# Altium schematic sheet Ring Flex Connector.SchDoc
size A2
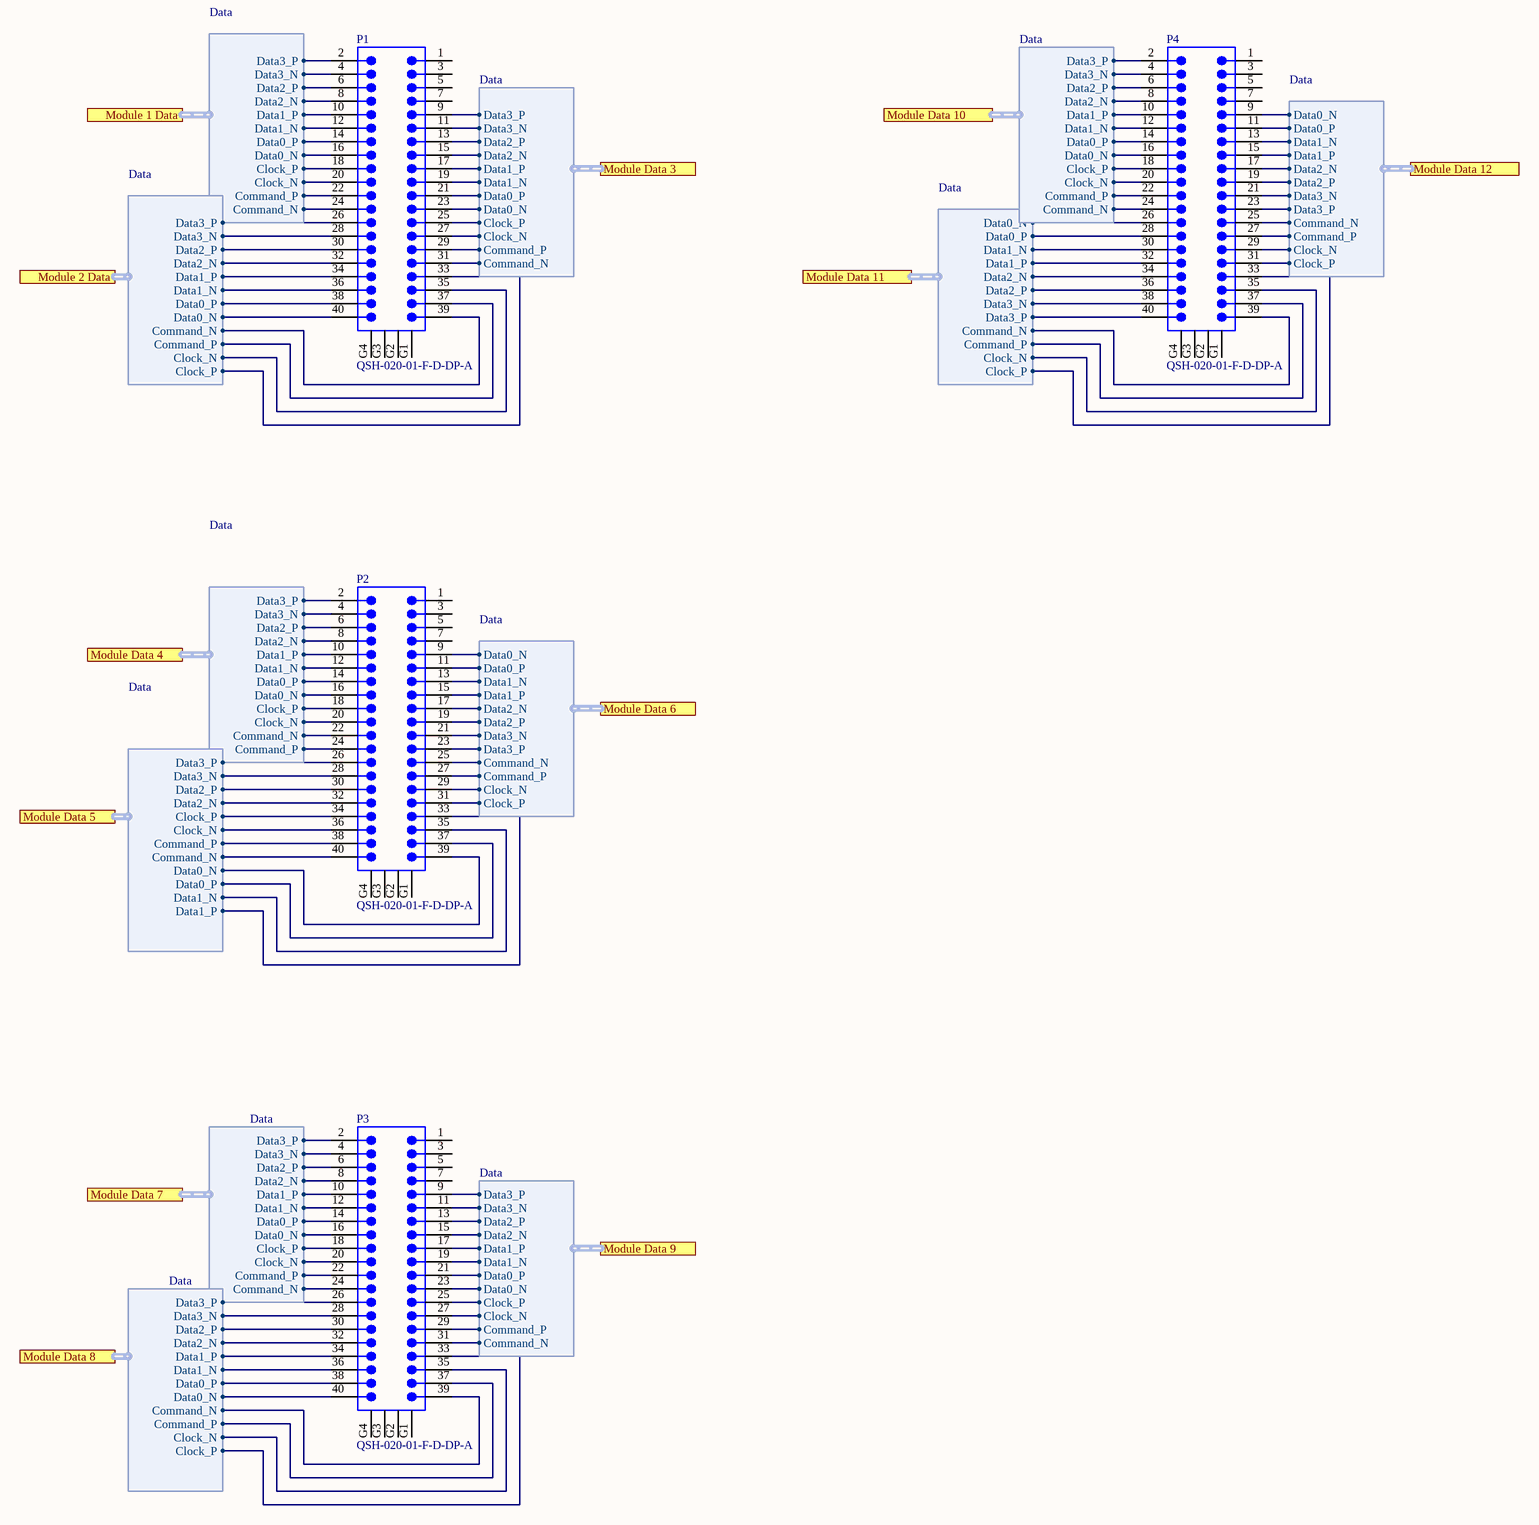
[diagram p0: Ring Flex Connector.SchDoc]

## Parts
P1  QSH-020-01-F-D-DP-A  [QSH-020-01-X-D-DP-A]
P2  QSH-020-01-F-D-DP-A  [QSH-020-01-X-D-DP-A]
P3  QSH-020-01-F-D-DP-A  [QSH-020-01-X-D-DP-A]
P4  QSH-020-01-F-D-DP-A  [QSH-020-01-X-D-DP-A]

## Ports
Module 1 Data (harness Data), Module 2 Data (harness Data), Module Data 3 (harness Data), Module Data 4 (harness Data), Module Data 5 (harness Data), Module Data 6 (harness Data), Module Data 7 (harness Data), Module Data 8 (harness Data), Module Data 9 (harness Data), Module Data 10 (harness Data), Module Data 11 (harness Data), Module Data 12 (harness Data)

## Harnesses
Data: Data0_N, Data0_P, Data1_N, Data1_P, Data2_N, Data2_P, Data3_N, Data3_P, Clock_P, Clock_N, Command_P, Command_N

## Nets
NetP1_2: P1.2 ; port Module 1 Data.Data3_P
NetP1_4: P1.4 ; port Module 1 Data.Data3_N
NetP1_6: P1.6 ; port Module 1 Data.Data2_P
NetP1_8: P1.8 ; port Module 1 Data.Data2_N
NetP1_9: P1.9 ; port Module Data 3.Data3_P
NetP1_10: P1.10 ; port Module 1 Data.Data1_P
NetP1_11: P1.11 ; port Module Data 3.Data3_N
NetP1_12: P1.12 ; port Module 1 Data.Data1_N
NetP1_13: P1.13 ; port Module Data 3.Data2_P
NetP1_14: P1.14 ; port Module 1 Data.Data0_P
NetP1_15: P1.15 ; port Module Data 3.Data2_N
NetP1_16: P1.16 ; port Module 1 Data.Data0_N
NetP1_17: P1.17 ; port Module Data 3.Data1_P
NetP1_18: P1.18 ; port Module 1 Data.Clock_P
NetP1_19: P1.19 ; port Module Data 3.Data1_N
NetP1_20: P1.20 ; port Module 1 Data.Clock_N
NetP1_21: P1.21 ; port Module Data 3.Data0_P
NetP1_22: P1.22 ; port Module 1 Data.Command_P
NetP1_23: P1.23 ; port Module Data 3.Data0_N
NetP1_24: P1.24 ; port Module 1 Data.Command_N
NetP1_25: P1.25 ; port Module Data 3.Clock_P
NetP1_26: P1.26 ; port Module 2 Data.Data3_P
NetP1_27: P1.27 ; port Module Data 3.Clock_N
NetP1_28: P1.28 ; port Module 2 Data.Data3_N
NetP1_29: P1.29 ; port Module Data 3.Command_P
NetP1_30: P1.30 ; port Module 2 Data.Data2_P
NetP1_31: P1.31 ; port Module Data 3.Command_N
NetP1_32: P1.32 ; port Module 2 Data.Data2_N
NetP1_33: P1.33 ; port Module 2 Data.Clock_P
NetP1_34: P1.34 ; port Module 2 Data.Data1_P
NetP1_35: P1.35 ; port Module 2 Data.Clock_N
NetP1_36: P1.36 ; port Module 2 Data.Data1_N
NetP1_37: P1.37 ; port Module 2 Data.Command_P
NetP1_38: P1.38 ; port Module 2 Data.Data0_P
NetP1_39: P1.39 ; port Module 2 Data.Command_N
NetP1_40: P1.40 ; port Module 2 Data.Data0_N
NetP2_2: P2.2 ; port Module Data 4.Data3_P
NetP2_4: P2.4 ; port Module Data 4.Data3_N
NetP2_6: P2.6 ; port Module Data 4.Data2_P
NetP2_8: P2.8 ; port Module Data 4.Data2_N
NetP2_9: P2.9 ; port Module Data 6.Data0_N
NetP2_10: P2.10 ; port Module Data 4.Data1_P
NetP2_11: P2.11 ; port Module Data 6.Data0_P
NetP2_12: P2.12 ; port Module Data 4.Data1_N
NetP2_13: P2.13 ; port Module Data 6.Data1_N
NetP2_14: P2.14 ; port Module Data 4.Data0_P
NetP2_15: P2.15 ; port Module Data 6.Data1_P
NetP2_16: P2.16 ; port Module Data 4.Data0_N
NetP2_17: P2.17 ; port Module Data 6.Data2_N
NetP2_18: P2.18 ; port Module Data 4.Clock_P
NetP2_19: P2.19 ; port Module Data 6.Data2_P
NetP2_20: P2.20 ; port Module Data 4.Clock_N
NetP2_21: P2.21 ; port Module Data 6.Data3_N
NetP2_22: P2.22 ; port Module Data 4.Command_N
NetP2_23: P2.23 ; port Module Data 6.Data3_P
NetP2_24: P2.24 ; port Module Data 4.Command_P
NetP2_25: P2.25 ; port Module Data 6.Command_N
NetP2_26: P2.26 ; port Module Data 5.Data3_P
NetP2_27: P2.27 ; port Module Data 6.Command_P
NetP2_28: P2.28 ; port Module Data 5.Data3_N
NetP2_29: P2.29 ; port Module Data 6.Clock_N
NetP2_30: P2.30 ; port Module Data 5.Data2_P
NetP2_31: P2.31 ; port Module Data 6.Clock_P
NetP2_32: P2.32 ; port Module Data 5.Data2_N
NetP2_33: P2.33 ; port Module Data 5.Data1_P
NetP2_34: P2.34 ; port Module Data 5.Clock_P
NetP2_35: P2.35 ; port Module Data 5.Data1_N
NetP2_36: P2.36 ; port Module Data 5.Clock_N
NetP2_37: P2.37 ; port Module Data 5.Data0_P
NetP2_38: P2.38 ; port Module Data 5.Command_P
NetP2_39: P2.39 ; port Module Data 5.Data0_N
NetP2_40: P2.40 ; port Module Data 5.Command_N
NetP3_2: P3.2 ; port Module Data 7.Data3_P
NetP3_4: P3.4 ; port Module Data 7.Data3_N
NetP3_6: P3.6 ; port Module Data 7.Data2_P
NetP3_8: P3.8 ; port Module Data 7.Data2_N
NetP3_9: P3.9 ; port Module Data 9.Data3_P
NetP3_10: P3.10 ; port Module Data 7.Data1_P
NetP3_11: P3.11 ; port Module Data 9.Data3_N
NetP3_12: P3.12 ; port Module Data 7.Data1_N
NetP3_13: P3.13 ; port Module Data 9.Data2_P
NetP3_14: P3.14 ; port Module Data 7.Data0_P
NetP3_15: P3.15 ; port Module Data 9.Data2_N
NetP3_16: P3.16 ; port Module Data 7.Data0_N
NetP3_17: P3.17 ; port Module Data 9.Data1_P
NetP3_18: P3.18 ; port Module Data 7.Clock_P
NetP3_19: P3.19 ; port Module Data 9.Data1_N
NetP3_20: P3.20 ; port Module Data 7.Clock_N
NetP3_21: P3.21 ; port Module Data 9.Data0_P
NetP3_22: P3.22 ; port Module Data 7.Command_P
NetP3_23: P3.23 ; port Module Data 9.Data0_N
NetP3_24: P3.24 ; port Module Data 7.Command_N
NetP3_25: P3.25 ; port Module Data 9.Clock_P
NetP3_26: P3.26 ; port Module Data 8.Data3_P
NetP3_27: P3.27 ; port Module Data 9.Clock_N
NetP3_28: P3.28 ; port Module Data 8.Data3_N
NetP3_29: P3.29 ; port Module Data 9.Command_P
NetP3_30: P3.30 ; port Module Data 8.Data2_P
NetP3_31: P3.31 ; port Module Data 9.Command_N
NetP3_32: P3.32 ; port Module Data 8.Data2_N
NetP3_33: P3.33 ; port Module Data 8.Clock_P
NetP3_34: P3.34 ; port Module Data 8.Data1_P
NetP3_35: P3.35 ; port Module Data 8.Clock_N
NetP3_36: P3.36 ; port Module Data 8.Data1_N
NetP3_37: P3.37 ; port Module Data 8.Command_P
NetP3_38: P3.38 ; port Module Data 8.Data0_P
NetP3_39: P3.39 ; port Module Data 8.Command_N
NetP3_40: P3.40 ; port Module Data 8.Data0_N
NetP4_2: P4.2 ; port Module Data 10.Data3_P
NetP4_4: P4.4 ; port Module Data 10.Data3_N
NetP4_6: P4.6 ; port Module Data 10.Data2_P
NetP4_8: P4.8 ; port Module Data 10.Data2_N
NetP4_9: P4.9 ; port Module Data 12.Data0_N
NetP4_10: P4.10 ; port Module Data 10.Data1_P
NetP4_11: P4.11 ; port Module Data 12.Data0_P
NetP4_12: P4.12 ; port Module Data 10.Data1_N
NetP4_13: P4.13 ; port Module Data 12.Data1_N
NetP4_14: P4.14 ; port Module Data 10.Data0_P
NetP4_15: P4.15 ; port Module Data 12.Data1_P
NetP4_16: P4.16 ; port Module Data 10.Data0_N
NetP4_17: P4.17 ; port Module Data 12.Data2_N
NetP4_18: P4.18 ; port Module Data 10.Clock_P
NetP4_19: P4.19 ; port Module Data 12.Data2_P
NetP4_20: P4.20 ; port Module Data 10.Clock_N
NetP4_21: P4.21 ; port Module Data 12.Data3_N
NetP4_22: P4.22 ; port Module Data 10.Command_P
NetP4_23: P4.23 ; port Module Data 12.Data3_P
NetP4_24: P4.24 ; port Module Data 10.Command_N
NetP4_25: P4.25 ; port Module Data 12.Command_N
NetP4_26: P4.26 ; port Module Data 11.Data0_N
NetP4_27: P4.27 ; port Module Data 12.Command_P
NetP4_28: P4.28 ; port Module Data 11.Data0_P
NetP4_29: P4.29 ; port Module Data 12.Clock_N
NetP4_30: P4.30 ; port Module Data 11.Data1_N
NetP4_31: P4.31 ; port Module Data 12.Clock_P
NetP4_32: P4.32 ; port Module Data 11.Data1_P
NetP4_33: P4.33 ; port Module Data 11.Clock_P
NetP4_34: P4.34 ; port Module Data 11.Data2_N
NetP4_35: P4.35 ; port Module Data 11.Clock_N
NetP4_36: P4.36 ; port Module Data 11.Data2_P
NetP4_37: P4.37 ; port Module Data 11.Command_P
NetP4_38: P4.38 ; port Module Data 11.Data3_N
NetP4_39: P4.39 ; port Module Data 11.Command_N
NetP4_40: P4.40 ; port Module Data 11.Data3_P

Not connected (* = marked no-connect by the designer): P1 1 3 5 7 G1 G2 G3 G4; P2 1 3 5 7 G1 G2 G3 G4; P3 1 3 5 7 G1 G2 G3 G4; P4 1 3 5 7 G1 G2 G3 G4

## Notes on the sheet
- Title
- Size:
- Date:
- File:
- A2
- Number:
- Time:
- Revision:
- Sheet
- of

## Library data of the parts
P1-P4 = CN-2P-M-40: Board-to-Board Connector, Differnetial Pair, Vertical, 2-Row, Pitch 0.50mm, 40-Position, Male